# Altium project UAV_Main_Board.PrjPcb (part 2 of 2)

## Sheet Main_3.SchDoc
size 400 x 299 mm; SheetNumber: 6; SheetTotal: 12
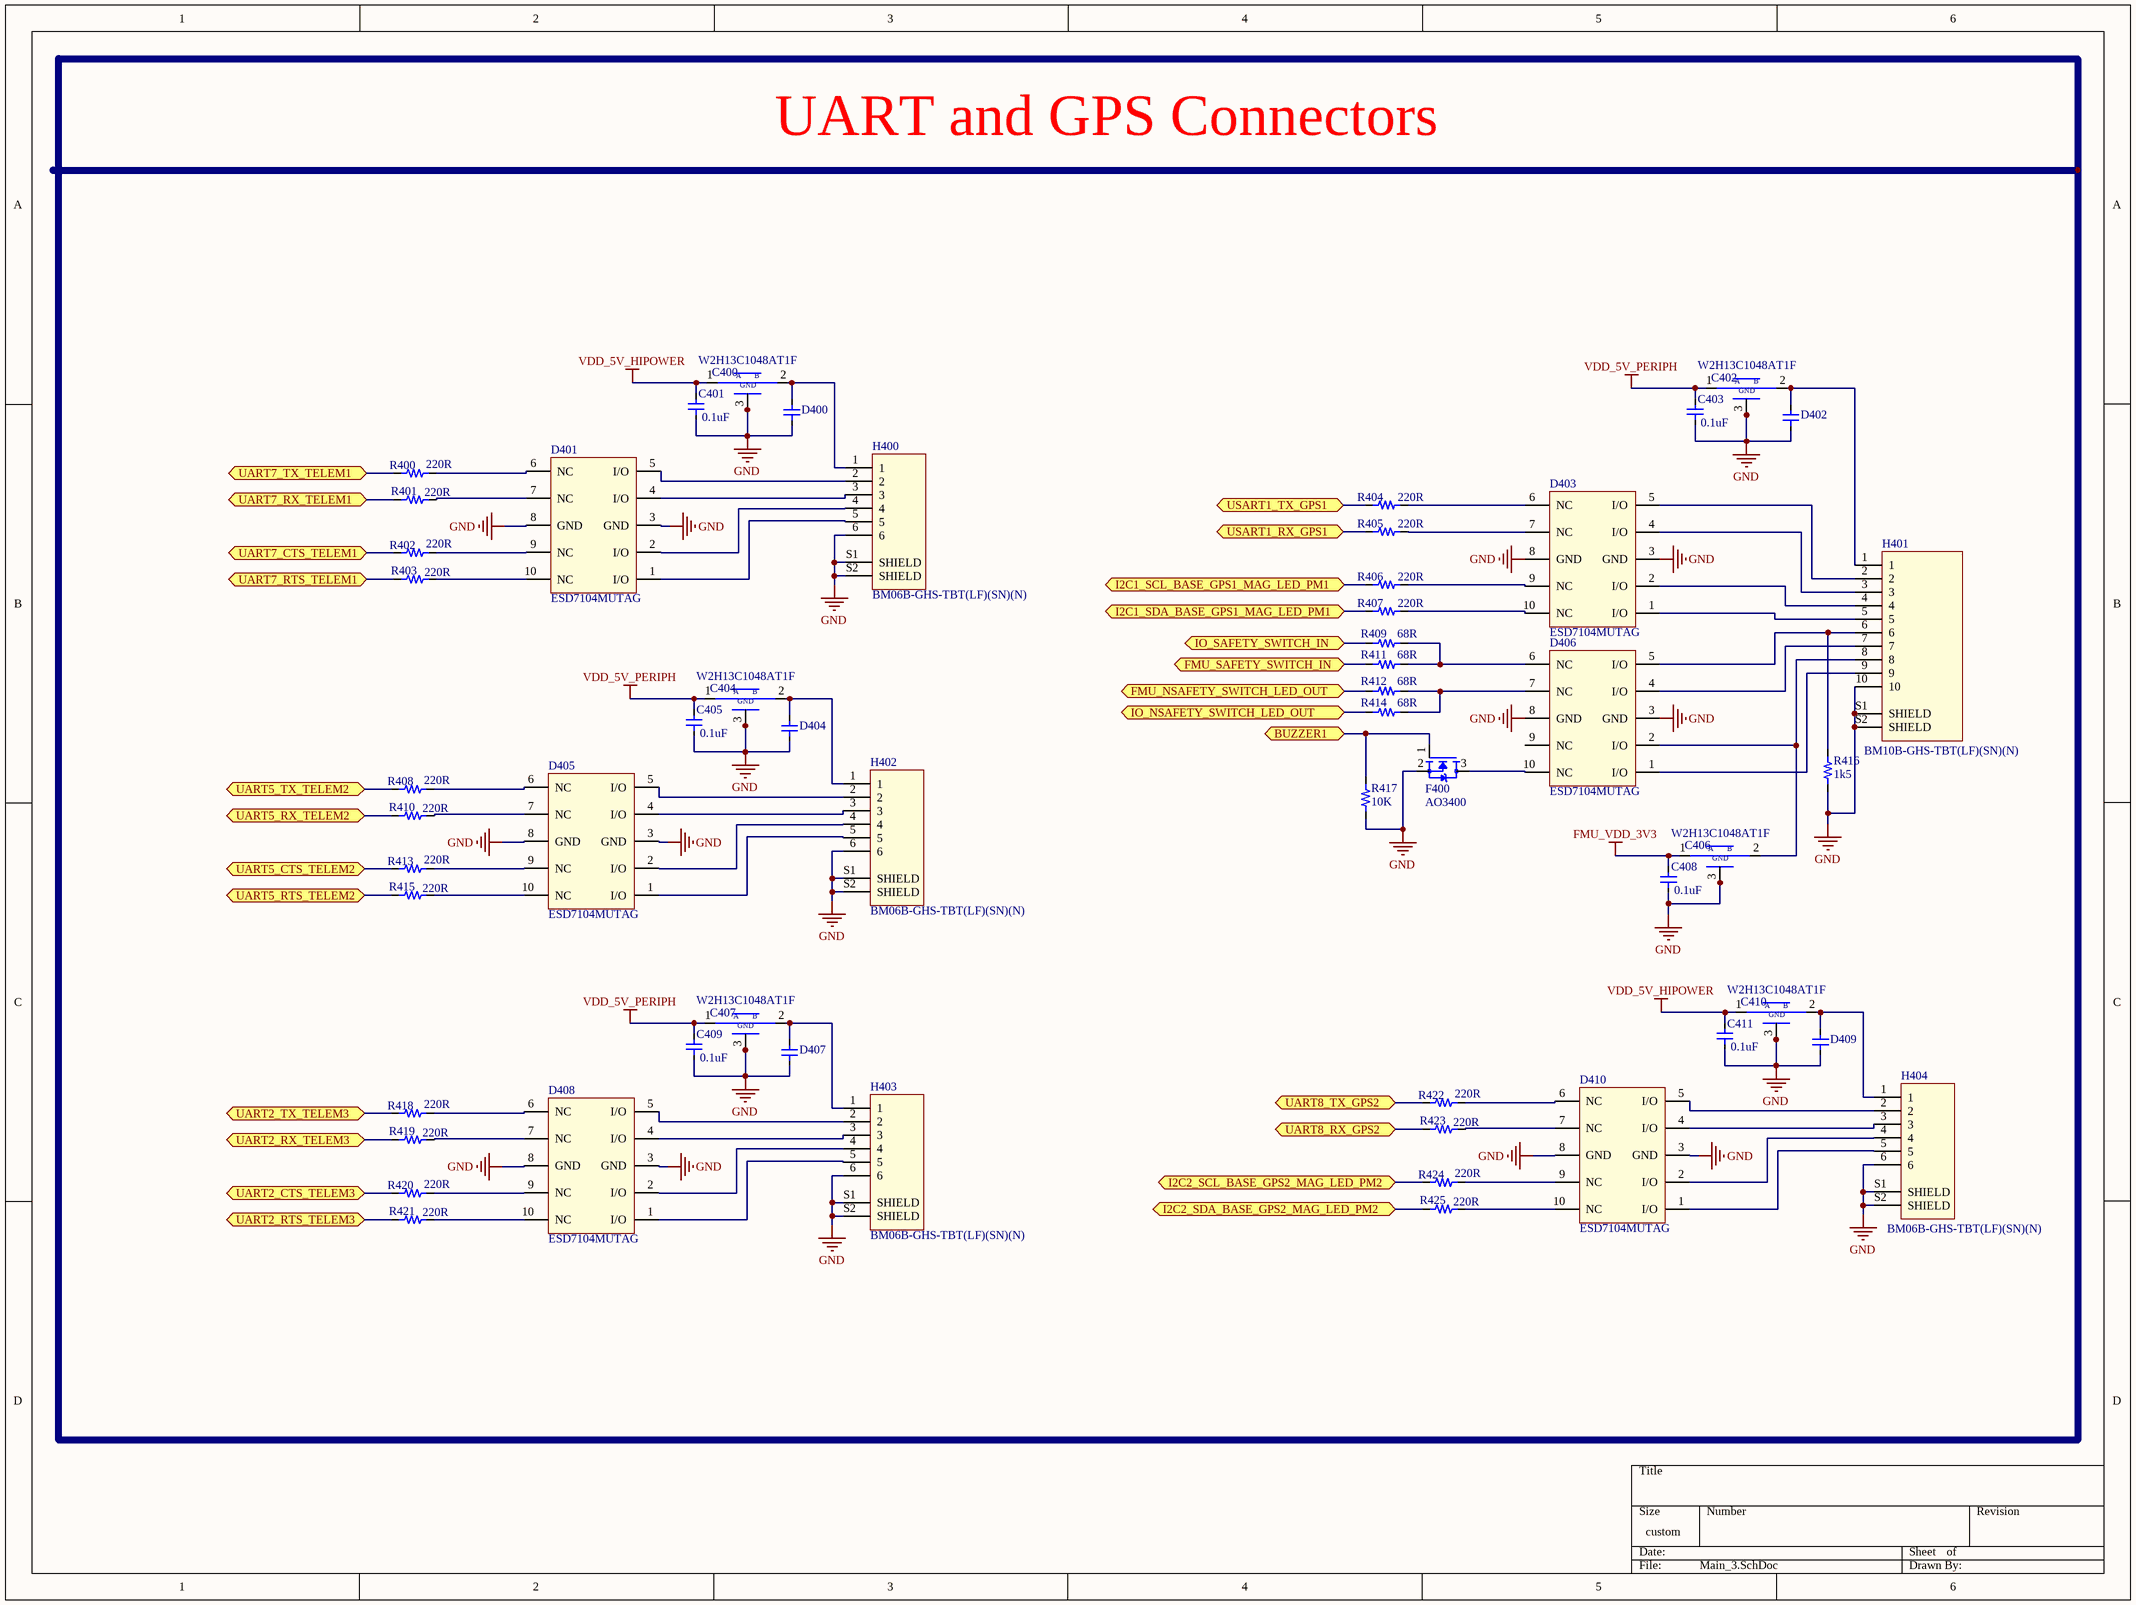
[diagram p11: Main_3.SchDoc]

### Parts
C400  W2H13C1048AT1F  [W2H13C1048AT1F]
C401  0.1uF  [C0603]
C402  W2H13C1048AT1F  [W2H13C1048AT1F]
C403  0.1uF  [C0603]
C404  W2H13C1048AT1F  [W2H13C1048AT1F]
C405  0.1uF  [C0603]
C406  W2H13C1048AT1F  [W2H13C1048AT1F]
C407  W2H13C1048AT1F  [W2H13C1048AT1F]
C408  0.1uF  [C0603]
C409  0.1uF  [C0603]
C410  W2H13C1048AT1F  [W2H13C1048AT1F]
C411  0.1uF  [C0603]
D400  PESD0402-140  [PESD0402-140]  (value not drawn)
D401  ESD7104MUTAG  [UDFN10 2.5x1, 0.5P]
D402  PESD0402-140  [PESD0402-140]  (value not drawn)
D403  ESD7104MUTAG  [UDFN10 2.5x1, 0.5P]
D404  PESD0402-140  [PESD0402-140]  (value not drawn)
D405  ESD7104MUTAG  [UDFN10 2.5x1, 0.5P]
D406  ESD7104MUTAG  [UDFN10 2.5x1, 0.5P]
D407  PESD0402-140  [PESD0402-140]  (value not drawn)
D408  ESD7104MUTAG  [UDFN10 2.5x1, 0.5P]
D409  PESD0402-140  [PESD0402-140]  (value not drawn)
D410  ESD7104MUTAG  [UDFN10 2.5x1, 0.5P]
F400  AO3400  [SOT-23]
H400  BM06B-GHS-TBT(LF)(SN)(N)  [BM06B-GHS-TBT(LF)(SN)(N)]
H401  BM10B-GHS-TBT(LF)(SN)(N)  [BM10B-GHS-TBT(LF)(SN)(N)]
H402  BM06B-GHS-TBT(LF)(SN)(N)  [BM06B-GHS-TBT(LF)(SN)(N)]
H403  BM06B-GHS-TBT(LF)(SN)(N)  [BM06B-GHS-TBT(LF)(SN)(N)]
H404  BM06B-GHS-TBT(LF)(SN)(N)  [BM06B-GHS-TBT(LF)(SN)(N)]
R400  220R  [R0402]
R401  220R  [R0402]
R402  220R  [R0402]
R403  220R  [R0402]
R404  220R  [R0402]
R405  220R  [R0402]
R406  220R  [R0402]
R407  220R  [R0402]
R408  220R  [R0402]
R409  68R  [R0402]
R410  220R  [R0402]
R411  68R  [R0402]
R412  68R  [R0402]
R413  220R  [R0402]
R414  68R  [R0402]
R415  220R  [R0402]
R416  1k5  [R0402]
R417  10K  [R0402]
R418  220R  [R0402]
R419  220R  [R0402]
R420  220R  [R0402]
R421  220R  [R0402]
R422  220R  [R0402]
R423  220R  [R0402]
R424  220R  [R0402]
R425  220R  [R0402]

### Ports
BUZZER1 (bidir), FMU_NSAFETY_SWITCH_LED_OUT (bidir), FMU_SAFETY_SWITCH_IN (bidir), I2C1_SCL_BASE_GPS1_MAG_LED_PM1 (bidir), I2C1_SDA_BASE_GPS1_MAG_LED_PM1 (bidir), I2C2_SCL_BASE_GPS2_MAG_LED_PM2 (bidir), I2C2_SDA_BASE_GPS2_MAG_LED_PM2 (bidir), IO_NSAFETY_SWITCH_LED_OUT (bidir), IO_SAFETY_SWITCH_IN (bidir), UART2_CTS_TELEM3 (bidir), UART2_RTS_TELEM3 (bidir), UART2_RX_TELEM3 (bidir), UART2_TX_TELEM3 (bidir), UART5_CTS_TELEM2 (bidir), UART5_RTS_TELEM2 (bidir), UART5_RX_TELEM2 (bidir), UART5_TX_TELEM2 (bidir), UART7_CTS_TELEM1 (bidir), UART7_RTS_TELEM1 (bidir), UART7_RX_TELEM1 (bidir), UART7_TX_TELEM1 (bidir), UART8_RX_GPS2 (bidir), UART8_TX_GPS2 (bidir), USART1_RX_GPS1 (bidir), USART1_TX_GPS1 (bidir)

### Nets
FMU_VDD_3V3: C406.1 C408.2
GND: C400.3 C400.4 C401.1 C402.3 C402.4 C403.1 C404.3 C404.4 C405.1 C406.3 C406.4 C407.3 C407.4 C408.1 C409.1 C410.3 C410.4 C411.1 D400.1 D401.3(GND) D401.8(GND) D402.1 D403.3(GND) D403.8(GND) D404.1 D405.3(GND) D405.8(GND) D406.3(GND) D406.8(GND) D407.1 D408.3(GND) D408.8(GND) D409.1 D410.3(GND) D410.8(GND) F400.2(S) H400.6 H400.S1(SHIELD) H400.S2(SHIELD) H401.10 H401.S1(SHIELD) H401.S2(SHIELD) H402.6 H402.S1(SHIELD) H402.S2(SHIELD) H403.6 H403.S1(SHIELD) H403.S2(SHIELD) H404.6 H404.S1(SHIELD) H404.S2(SHIELD) R416.1 R417.1
VDD_5V_HIPOWER: C400.1 C401.2 C410.1 C411.2
VDD_5V_PERIPH: C402.1 C403.2 C404.1 C405.2 C407.1 C409.2
NetC400_2: C400.2 D400.2 H400.1
NetC402_2: C402.2 D402.2 H401.1
NetC404_2: C404.2 D404.2 H402.1
NetC406_2: C406.2 D406.2(I/O) H401.8
NetC407_2: C407.2 D407.2 H403.1
NetC410_2: C410.2 D409.2 H404.1
NetD401_1: D401.1(I/O) H400.5
NetD401_2: D401.2(I/O) H400.4
NetD401_4: D401.4(I/O) H400.3
NetD401_5: D401.5(I/O) H400.2
NetD401_6: D401.6(NC) R400.2
NetD401_7: D401.7(NC) R401.2
NetD401_9: D401.9(NC) R402.2
NetD401_10: D401.10(NC) R403.2
NetD403_1: D403.1(I/O) H401.5
NetD403_2: D403.2(I/O) H401.4
NetD403_4: D403.4(I/O) H401.3
NetD403_5: D403.5(I/O) H401.2
NetD403_6: D403.6(NC) R404.2
NetD403_7: D403.7(NC) R405.2
NetD403_9: D403.9(NC) R406.2
NetD403_10: D403.10(NC) R407.2
NetD405_1: D405.1(I/O) H402.5
NetD405_2: D405.2(I/O) H402.4
NetD405_4: D405.4(I/O) H402.3
NetD405_5: D405.5(I/O) H402.2
NetD405_6: D405.6(NC) R408.2
NetD405_7: D405.7(NC) R410.2
NetD405_9: D405.9(NC) R413.2
NetD405_10: D405.10(NC) R415.2
NetD406_1: D406.1(I/O) H401.9
NetD406_4: D406.4(I/O) H401.7
NetD406_5: D406.5(I/O) H401.6 R416.2
NetD406_6: D406.6(NC) R409.2 R411.2
NetD406_7: D406.7(NC) R412.2 R414.2
NetD406_10: D406.10(NC) F400.3(D)
NetD408_1: D408.1(I/O) H403.5
NetD408_2: D408.2(I/O) H403.4
NetD408_4: D408.4(I/O) H403.3
NetD408_5: D408.5(I/O) H403.2
NetD408_6: D408.6(NC) R418.2
NetD408_7: D408.7(NC) R419.2
NetD408_9: D408.9(NC) R420.2
NetD408_10: D408.10(NC) R421.2
NetD410_1: D410.1(I/O) H404.5
NetD410_2: D410.2(I/O) H404.4
NetD410_4: D410.4(I/O) H404.3
NetD410_5: D410.5(I/O) H404.2
NetD410_6: D410.6(NC) R422.2
NetD410_7: D410.7(NC) R423.2
NetD410_9: D410.9(NC) R424.2
NetD410_10: D410.10(NC) R425.2
NetF400_1: F400.1(G) R417.2 ; port BUZZER1
NetR9_1: R406.1 ; port I2C1_SCL_BASE_GPS1_MAG_LED_PM1
NetR10_1: R407.1 ; port I2C1_SDA_BASE_GPS1_MAG_LED_PM1
NetR400_1: R400.1 ; port UART7_TX_TELEM1
NetR401_1: R401.1 ; port UART7_RX_TELEM1
NetR402_1: R402.1 ; port UART7_CTS_TELEM1
NetR403_1: R403.1 ; port UART7_RTS_TELEM1
NetR404_1: R404.1 ; port USART1_TX_GPS1
NetR405_1: R405.1 ; port USART1_RX_GPS1
NetR408_1: R408.1 ; port UART5_TX_TELEM2
NetR409_1: R409.1 ; port IO_SAFETY_SWITCH_IN
NetR410_1: R410.1 ; port UART5_RX_TELEM2
NetR411_1: R411.1 ; port FMU_SAFETY_SWITCH_IN
NetR412_1: R412.1 ; port FMU_NSAFETY_SWITCH_LED_OUT
NetR413_1: R413.1 ; port UART5_CTS_TELEM2
NetR414_1: R414.1 ; port IO_NSAFETY_SWITCH_LED_OUT
NetR415_1: R415.1 ; port UART5_RTS_TELEM2
NetR418_1: R418.1 ; port UART2_TX_TELEM3
NetR419_1: R419.1 ; port UART2_RX_TELEM3
NetR420_1: R420.1 ; port UART2_CTS_TELEM3
NetR421_1: R421.1 ; port UART2_RTS_TELEM3
NetR422_1: R422.1 ; port UART8_TX_GPS2
NetR423_1: R423.1 ; port UART8_RX_GPS2
NetR424_1: R424.1 ; port I2C2_SCL_BASE_GPS2_MAG_LED_PM2
NetR425_1: R425.1 ; port I2C2_SDA_BASE_GPS2_MAG_LED_PM2

Not connected (* = marked no-connect by the designer): D406 9(NC)

### Notes on the sheet
- UART and GPS Connectors
- (in symbol W2H13C1048AT1F) A; B; GND

### Library data of the parts
C400 C402 C404 C406 C407 C410 = W2H13C1048AT1F: Feed Through Capacitors 25V 0.1uF X7R
C401 C403 C405 C408 C409 C411 = CC0603KRX7R8BB104: CAP CER 0.1UF 25V X7R 0603
D400 D402 D404 D407 D409 = PESD0402-140: 40V Clamp - Ipp Tvs Diode Surface Mount 0402
D401 D403 D405 D406 D408 D410 = ESD7104MUTAG: TVS DIODE 5VWM 10VC 10UDFN
F400 = AO3400: N-Channel 30 V 5.8A (Ta) 1.5W (Ta) Surface Mount SOT-23
H400 H402-H404 = BM06B-GHS-TBT(LF)(SN)(N): Connector Header Surface Mount 6 position 0.049" (1.25mm)
H401 = BM10B-GHS-TBT(LF)(SN)(N): Connector Header Surface Mount 10 position 0.049" (1.25mm)
R400-R408 R410 R413 R415 R418-R425 = RC0402FR-07220RL: RES 220 OHM 1% 1/16W 0402
R409 R411 R412 R414 = RC0402FR-0768RL: 68 Ohms ±1% 0.063W, 1/16W Chip Resistor 0402 (1005 Metric) Moisture Resistant Thick Film
R416 = RC0402FR-131K5L: 1.5 kOhms ±1% 0.063W, 1/16W Chip Resistor 0402 (1005 Metric) Thick Film
R417 = RC1005F103CS: RES SMD 10K OHM 1% 1/16W 0402

## Sheet Main_5.SchDoc
size 219 x 240 mm; SheetNumber: 8; SheetTotal: 12
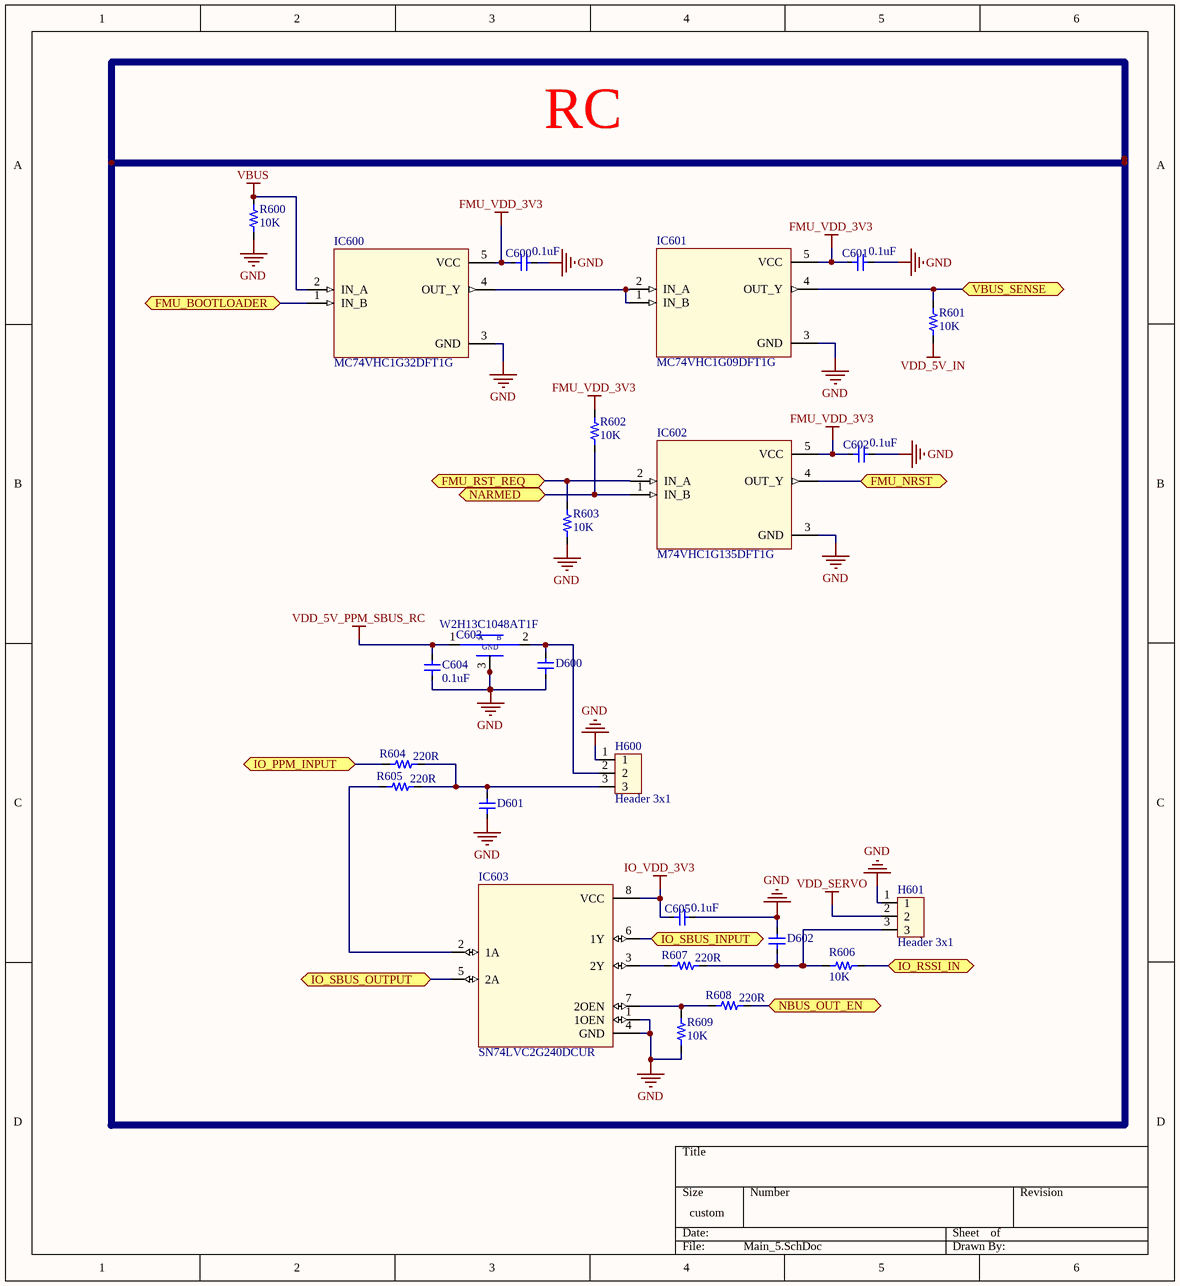
[diagram p12: Main_5.SchDoc]

### Parts
C600  0.1uF  [C0603]
C601  0.1uF  [C0603]
C602  0.1uF  [C0603]
C603  W2H13C1048AT1F  [W2H13C1048AT1F]
C604  0.1uF  [C0603]
C605  0.1uF  [C0603]
D600  PESD0402-140  [PESD0402-140]  (value not drawn)
D601  PESD0402-140  [PESD0402-140]  (value not drawn)
D602  PESD0402-140  [PESD0402-140]  (value not drawn)
H600  Header 3x1  [Header 3x1]
H601  Header 3x1  [Header 3x1]
IC600  MC74VHC1G32DFT1G  [SOT65P210X110-5N]
IC601  MC74VHC1G09DFT1G  [SOT65P210X110-5N]
IC602  M74VHC1G135DFT1G  [SOT65P210X110-5N]
IC603  SN74LVC2G240DCUR  [SN74LVC2G240DCUR]
R600  10K  [R0402]
R601  10K  [R0402]
R602  10K  [R0402]
R603  10K  [R0402]
R604  220R  [R0402]
R605  220R  [R0402]
R606  10K  [R0402]
R607  220R  [R0402]
R608  220R  [R0402]
R609  10K  [R0402]

### Ports
FMU_BOOTLOADER (bidir), FMU_NRST (bidir), FMU_RST_REQ (bidir), IO_PPM_INPUT (bidir), IO_RSSI_IN (bidir), IO_SBUS_INPUT (bidir), IO_SBUS_OUTPUT (bidir), NARMED (bidir), NBUS_OUT_EN (bidir), VBUS_SENSE (bidir)

### Nets
FMU_VDD_3V3: C600.1 C601.1 C602.1 IC600.5(VCC) IC601.5(VCC) IC602.5(VCC) R602.2
GND: C600.2 C601.2 C602.2 C603.3 C603.4 C604.1 C605.2 D600.1 D601.1 D602.2 H600.1 H601.1 IC600.3(GND) IC601.3(GND) IC602.3(GND) IC603.1(1OEN) IC603.4(GND) R600.1 R603.1 R609.1
IO_VDD_3V3: C605.1 IC603.8(VCC)
VBUS: IC600.2(IN_A) R600.2
VDD_5V_IN: R601.1
VDD_5V_PPM_SBUS_RC: C603.1 C604.2
VDD_SERVO: H601.2
IO_RSSI_IN: R606.2 ; port IO_RSSI_IN
NetC603_2: C603.2 D600.2 H600.2
NetD601_2: D601.2 H600.3 R604.2 R605.2
NetD602_1: D602.1 H601.3 R606.1 R607.2
NetIC600_1: IC600.1(IN_B) ; port FMU_BOOTLOADER
NetIC600_4: IC600.4(OUT_Y) IC601.1(IN_B) IC601.2(IN_A)
NetIC601_4: IC601.4(OUT_Y) R601.2 ; port VBUS_SENSE
NetIC602_1: IC602.1(IN_B) R602.1 ; port NARMED
NetIC602_2: IC602.2(IN_A) R603.2 ; port FMU_RST_REQ
NetIC602_4: IC602.4(OUT_Y) ; port FMU_NRST
NetIC603_2: IC603.2(1A) R605.1
NetIC603_3: IC603.3(2Y) R607.1
NetIC603_5: IC603.5(2A) ; port IO_SBUS_OUTPUT
NetIC603_6: IC603.6(1Y) ; port IO_SBUS_INPUT
NetIC603_7: IC603.7(2OEN) R608.1 R609.2
NetR604_1: R604.1 ; port IO_PPM_INPUT
NetR608_2: R608.2 ; port NBUS_OUT_EN

### Notes on the sheet
- RC
- (in symbol W2H13C1048AT1F) A; B; GND

### Library data of the parts
C600-C602 C604 C605 = CC0603KRX7R8BB104: CAP CER 0.1UF 25V X7R 0603
C603 = W2H13C1048AT1F: Feed Through Capacitors 25V 0.1uF X7R
D600-D602 = PESD0402-140: as D400 on sheet Main_3
IC600 = MC74VHC1G32DFT1G: IC GATE OR 1CH 2-INP SC88A
IC601 = MC74VHC1G09DFT1G: IC GATE AND 1CH 2-INP SC88A
IC602 = M74VHC1G135DFT1G: Single 2-Input NAND Gate, Schmitt Trigger ,Open Drain, SC-88A / SC-70-5
IC603 = SN74LVC2G240DCUR: 2-ch, 1.65-V to 5.5-V inverters with 3-state outputs
R600-R603 R606 R609 = RC1005F103CS: RES SMD 10K OHM 1% 1/16W 0402
R604 R605 R607 R608 = RC0402FR-07220RL: RES 220 OHM 1% 1/16W 0402

## Nets that join several sheets
BAT+_OUT: Power 12V_5V (28 pins), Current_Me (7 pins)
FMU_VDD_3V3: Main_4 (C502.1 C505.1 U500.5 U501.5), Main_7 (R800.1 R807.1), Main_1 (H201.1 R200.2 X200.84 X200.86), Main_9 (C1002.2 IC1000.1 IC1000.8), Main_3 (C406.1 C408.2), Main_5 (7 pins)
GND: Power 12V_5V (61 pins), Main_8 (24 pins), Main_6 (27 pins), Main_4 (22 pins), Main_2 (25 pins), Main_7 (27 pins), Current_Me (34 pins), Main_1 (47 pins), Main_9 (15 pins), Main_3 (53 pins), Main_5 (20 pins)
IO_VDD_3V3: Main_2 (10 pins), Main_7 (C808.2 C809.2 IC800.7 R801.2), Main_5 (C605.1 IC603.8)
V_RTC_BAT: Main_2 (U300.1), Main_1 (X200.29)
VBUS: Main_6 (11 pins), Main_5 (IC600.2 R600.2)
VDD_5V_BRICK1: Main_6 (6 pins), Current_Me (10 pins)
VDD_5V_HIPOWER: Main_7 (C811.2 C812.2 IC801.8), Main_3 (C400.1 C401.2 C410.1 C411.2)
VDD_5V_IN: Main_6 (7 pins), Main_2 (LED300.1 LED301.1 LED302.1), Main_7 (7 pins), Main_1 (X200.49 X200.51 X200.53 X200.55), Main_5 (R601.1)
VDD_5V_PERIPH: Main_4 (6 pins), Main_7 (C815.2 C816.2 IC802.8), Main_9 (C1000.1 C1001.2), Main_3 (6 pins)
VDD_5V_PPM_SBUS_RC: Main_7 (C814.2 D800.1), Main_5 (C603.1 C604.2)
VDD_SERVO: Power 12V_5V (8 pins), Main_8 (16 pins), Main_2 (R305.1), Main_5 (H601.2)
IO_RSSI_IN: Main_2 (U300.15 U300.33), Main_5 (R606.2)
NetC810_2: Main_2 (U300.7), Main_7 (C810.2 IC800.3 R801.1)
NetF400_1: Main_1 (X200.4), Main_3 (F400.1 R417.2)
NetIC601_4: Main_1 (X200.80), Main_5 (IC601.4 R601.2)
NetIC602_1: Main_1 (X200.85), Main_5 (IC602.1 R602.1)
NetIC602_2: Main_2 (U300.2), Main_5 (IC602.2 R603.2)
NetIC602_4: Main_1 (X200.87), Main_5 (IC602.4)
NetIC603_5: Main_2 (U300.21), Main_5 (IC603.5)
NetIC603_6: Main_2 (U300.22), Main_5 (IC603.6)
NetIC700_7: Main_6 (IC700.7), Main_1 (X200.89)
NetIC700_8: Main_6 (IC700.8), Main_1 (X200.91)
NetIC700_9: Main_6 (IC700.9), Main_1 (X200.93)
NetIC1000_5: Main_1 (X200.8), Main_9 (IC1000.5 R1001.1)
NetIC1000_6: Main_1 (X200.10), Main_9 (IC1000.6 R1000.1)
NetR9_1: Current_Me (R9.1), Main_1 (X200.16), Main_3 (R406.1)
NetR10_1: Current_Me (R10.1), Main_1 (X200.18), Main_3 (R407.1)
NetR300_2: Main_2 (R300.2), Main_1 (X200.70)
NetR301_2: Main_2 (R301.2), Main_1 (X200.72)
NetR400_1: Main_1 (X200.66), Main_3 (R400.1)
NetR401_1: Main_1 (X200.64), Main_3 (R401.1)
NetR402_1: Main_1 (X200.24), Main_3 (R402.1)
NetR403_1: Main_1 (X200.22), Main_3 (R403.1)
NetR404_1: Main_1 (X200.36), Main_3 (R404.1)
NetR405_1: Main_1 (X200.34), Main_3 (R405.1)
NetR408_1: Main_1 (X200.52), Main_3 (R408.1)
NetR409_1: Main_2 (U300.41), Main_3 (R409.1)
NetR410_1: Main_1 (X200.54), Main_3 (R410.1)
NetR411_1: Main_1 (X200.21), Main_3 (R411.1)
NetR412_1: Main_1 (X200.23), Main_3 (R412.1)
NetR413_1: Main_1 (X200.58), Main_3 (R413.1)
NetR414_1: Main_2 (U300.26), Main_3 (R414.1)
NetR415_1: Main_1 (X200.60), Main_3 (R415.1)
NetR418_1: Main_1 (X200.40), Main_3 (R418.1)
NetR419_1: Main_1 (X200.42), Main_3 (R419.1)
NetR420_1: Main_1 (X200.48), Main_3 (R420.1)
NetR421_1: Main_1 (X200.46), Main_3 (R421.1)
NetR422_1: Main_1 (X200.28), Main_3 (R422.1)
NetR423_1: Main_1 (X200.30), Main_3 (R423.1)
NetR424_1: Main_1 (X200.14), Main_3 (R424.1)
NetR425_1: Main_1 (X200.12), Main_3 (R425.1)
NetR604_1: Main_2 (U300.29), Main_5 (R604.1)
NetR608_2: Main_2 (U300.40), Main_5 (R608.2)
NetR701_2: Main_6 (R701.2), Main_1 (X200.78)
NetR702_2: Main_6 (R702.2), Main_1 (X200.76)
NetR802_2: Main_7 (R802.2), Main_1 (X200.83)
NetR803_1: Main_7 (R803.1), Main_1 (X200.33)
NetR804_2: Main_7 (R804.2), Main_1 (X200.81)
NetR808_2: Main_7 (R808.2), Main_1 (X200.37)
NetR809_2: Main_7 (R809.2), Main_1 (X200.35)
NetR900_1: Main_8 (R900.1), Main_1 (X200.1)
NetR901_1: Main_8 (R901.1), Main_1 (X200.3)
NetR902_1: Main_8 (R902.1), Main_1 (X200.5)
NetR903_1: Main_8 (R903.1), Main_1 (X200.7)
NetR904_1: Main_8 (R904.1), Main_1 (X200.11)
NetR905_1: Main_8 (R905.1), Main_1 (X200.13)
NetR906_1: Main_8 (R906.1), Main_1 (X200.15)
NetR907_1: Main_8 (R907.1), Main_1 (X200.17)
NetR908_1: Main_8 (R908.1), Main_2 (U300.46)
NetR909_1: Main_8 (R909.1), Main_2 (U300.45)
NetR910_1: Main_8 (R910.1), Main_2 (U300.11)
NetR911_1: Main_8 (R911.1), Main_2 (U300.10)
NetR912_1: Main_8 (R912.1), Main_2 (U300.19)
NetR913_1: Main_8 (R913.1), Main_2 (U300.18)
NetR914_1: Main_8 (R914.1), Main_2 (U300.17)
NetR915_1: Main_8 (R915.1), Main_2 (U300.16)
NetU500_1: Main_4 (U500.1 U501.1), Main_1 (X200.57 X200.63)
NetU500_4: Main_4 (U500.4 U501.4), Main_1 (X200.59 X200.65)